# Altium schematic sheet Divider.schdoc
size A; Organization: Altium Limited; Address1: L3, 12a Rodborough Rd; Address2: Frenchs Forest; Address3: NSW; Address4: Australia 2086; DocumentNumber: 2; SheetNumber: 2; SheetTotal: 2
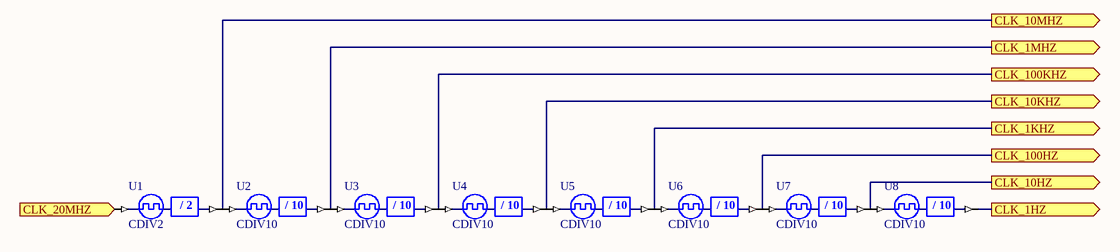
[diagram p0: Divider.schdoc]

## Parts
U1  CDIV2
U2  CDIV10
U3  CDIV10
U4  CDIV10
U5  CDIV10
U6  CDIV10
U7  CDIV10
U8  CDIV10

## Ports
CLK_1HZ (out), CLK_1KHZ (out), CLK_1MHZ (out), CLK_10HZ (out), CLK_10KHZ (out), CLK_10MHZ (out), CLK_20MHZ (in), CLK_100HZ (out), CLK_100KHZ (out)

## Nets
CLK_1HZ: U8.CLKDV ; port CLK_1HZ
CLK_1KHZ: U5.CLKDV U6.CLKIN ; port CLK_1KHZ
CLK_1MHZ: U2.CLKDV U3.CLKIN ; port CLK_1MHZ
CLK_10HZ: U7.CLKDV U8.CLKIN ; port CLK_10HZ
CLK_10KHZ: U4.CLKDV U5.CLKIN ; port CLK_10KHZ
CLK_10MHZ: U1.CLKDV U2.CLKIN ; port CLK_10MHZ
CLK_20MHZ: U1.CLKIN ; port CLK_20MHZ
CLK_100HZ: U6.CLKDV U7.CLKIN ; port CLK_100HZ
CLK_100KHZ: U3.CLKDV U4.CLKIN ; port CLK_100KHZ

## Notes on the sheet
- Title
- Size:
- Date:
- A
- Number:
- Time:
- Revision:
- Sheet
- of
- File:
- (in symbol CDIV2) / 2
- (in symbol CDIV10) / 10

## Library data of the parts
U1 = CDIV2: Clock Divider by 2; ArchiveName: GENERIC; Published: 18-Nov-2003; Publisher: Altium Limited; Core Revision: 1.00.00
U2-U8 = CDIV10: Clock Divider by 10; ArchiveName: GENERIC; Published: 18-Nov-2003; Publisher: Altium Limited; Core Revision: 1.00.00